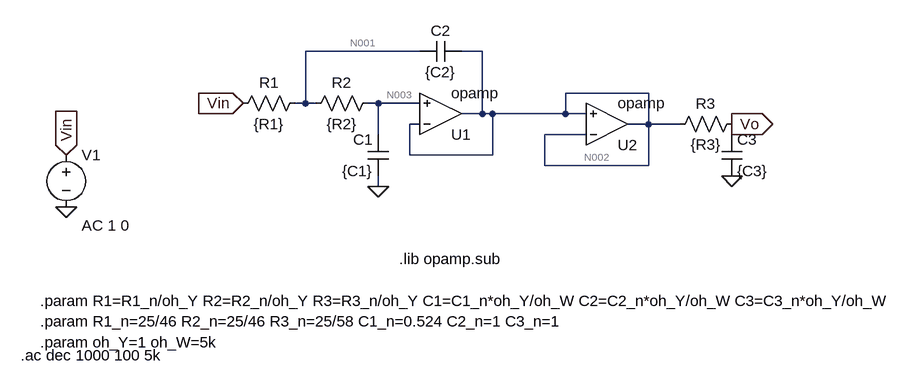
[diagram p0: schematic Draft1.asc]
Draft1.asc, the LTspice schematic file:
Version 4
SHEET 1 1308 680
WIRE 176 -96 0 -96
WIRE 272 -96 240 -96
WIRE 528 -32 400 -32
WIRE 0 -16 0 -96
WIRE 0 -16 -16 -16
WIRE 16 -16 0 -16
WIRE 112 -16 96 -16
WIRE 176 -16 112 -16
WIRE 272 0 272 -96
WIRE 272 0 240 0
WIRE 288 0 272 0
WIRE 400 0 400 -32
WIRE 400 0 288 0
WIRE 432 0 400 0
WIRE 176 16 160 16
WIRE 528 16 528 -32
WIRE 528 16 496 16
WIRE 576 16 528 16
WIRE 112 32 112 -16
WIRE 432 32 368 32
WIRE 656 32 656 16
WIRE 160 64 160 16
WIRE 288 64 288 0
WIRE 288 64 160 64
WIRE 368 80 368 32
WIRE 528 80 528 16
WIRE 528 80 368 80
WIRE 112 112 112 96
FLAG 112 112 0
FLAG -96 -16 Vin
IOPIN -96 -16 In
FLAG -368 144 0
FLAG -368 64 Vin
IOPIN -368 64 In
FLAG 656 96 0
FLAG 656 16 Vo
IOPIN 656 16 Out
SYMBOL OpAmps\\opamp 208 64 M180
SYMATTR InstName U1
SYMBOL cap 128 96 R180
WINDOW 0 24 56 Left 2
WINDOW 3 24 8 Left 2
SYMATTR InstName C1
SYMATTR Value {C1}
SYMBOL res 0 -32 R90
WINDOW 0 0 56 VBottom 2
WINDOW 3 32 56 VTop 2
SYMATTR InstName R1
SYMATTR Value {R1}
SYMBOL res 112 -32 R90
WINDOW 0 0 56 VBottom 2
WINDOW 3 32 56 VTop 2
SYMATTR InstName R2
SYMATTR Value {R2}
SYMBOL cap 240 -112 R90
WINDOW 0 0 32 VBottom 2
WINDOW 3 32 32 VTop 2
SYMATTR InstName C2
SYMATTR Value {C2}
SYMBOL voltage -368 48 R0
WINDOW 123 24 124 Left 2
WINDOW 39 0 0 Left 0
SYMATTR InstName V1
SYMATTR Value ""
SYMATTR Value2 AC 1 0
SYMBOL res 560 32 R270
WINDOW 0 32 56 VTop 2
WINDOW 3 0 56 VBottom 2
SYMATTR InstName R3
SYMATTR Value {R3}
SYMBOL cap 640 32 R0
SYMATTR InstName C3
SYMATTR Value {C3}
SYMBOL OpAmps\\opamp 464 80 M180
SYMATTR InstName U2
TEXT 144 224 Left 2 !.lib opamp.sub
TEXT -408 288 Left 2 !.param R1=R1_n/oh_Y R2=R2_n/oh_Y R3=R3_n/oh_Y C1=C1_n*oh_Y/oh_W C2=C2_n*oh_Y/oh_W C3=C3_n*oh_Y/oh_W
TEXT -408 320 Left 2 !.param R1_n=25/46 R2_n=25/46 R3_n=25/58 C1_n=0.524 C2_n=1 C3_n=1
TEXT -408 352 Left 2 !.param oh_Y=1 oh_W=5k
TEXT -438 372 Left 2 !.ac dec 1000 100 5k

The netlist it stands for:
* Draft1.asc
XU1 N002 N003 N002 opamp Aol=100K GBW=10Meg  ; pins invin noninvin out
C1 0 N003 {C1}
R1 N001 Vin {R1}
R2 N003 N001 {R2}
C2 N002 N001 {C2}
V1 Vin 0 AC 1 0
R3 N002 Vo {R3}
C3 Vo 0 {C3}
XU2 N002 N002 N002 opamp Aol=100K GBW=10Meg  ; pins invin noninvin out
.lib opamp.sub
.param R1=R1_n/oh_Y R2=R2_n/oh_Y R3=R3_n/oh_Y C1=C1_n*oh_Y/oh_W C2=C2_n*oh_Y/oh_W C3=C3_n*oh_Y/oh_W
.param R1_n=25/46 R2_n=25/46 R3_n=25/58 C1_n=0.524 C2_n=1 C3_n=1
.param oh_Y=1 oh_W=5k
.ac dec 1000 100 5k
.backanno
.end

* Results of the author's LTspice run, read from the files saved beside the schematic
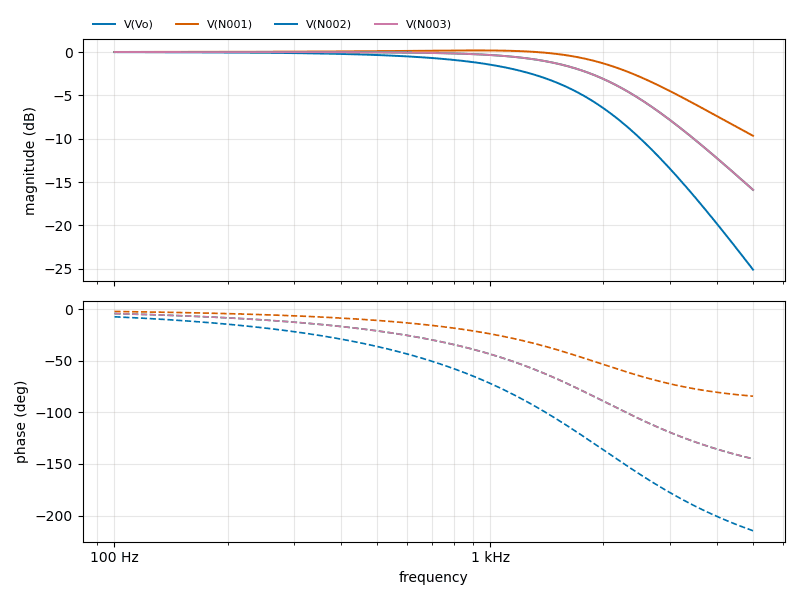
[diagram p1: AC Analysis of Draft1.asc, plotted from the saved traces]
* AC Analysis, 1 run:
*   V(Vo): -0.01 dB at 100 Hz, -25.12 dB at 5 kHz, peak -0.01 dB at 100 Hz, 3 dB below the peak at 1.399 kHz
*   V(N001): 0.00 dB at 100 Hz, -9.67 dB at 5 kHz, peak 0.18 dB at 912 Hz, 3 dB below the peak at 2.489 kHz
*   V(N002): -0.00 dB at 100 Hz, -15.91 dB at 5 kHz, peak -0.00 dB at 100 Hz, 3 dB below the peak at 1.975 kHz
*   V(N003): -0.00 dB at 100 Hz, -15.91 dB at 5 kHz, peak -0.00 dB at 100 Hz, 3 dB below the peak at 1.975 kHz